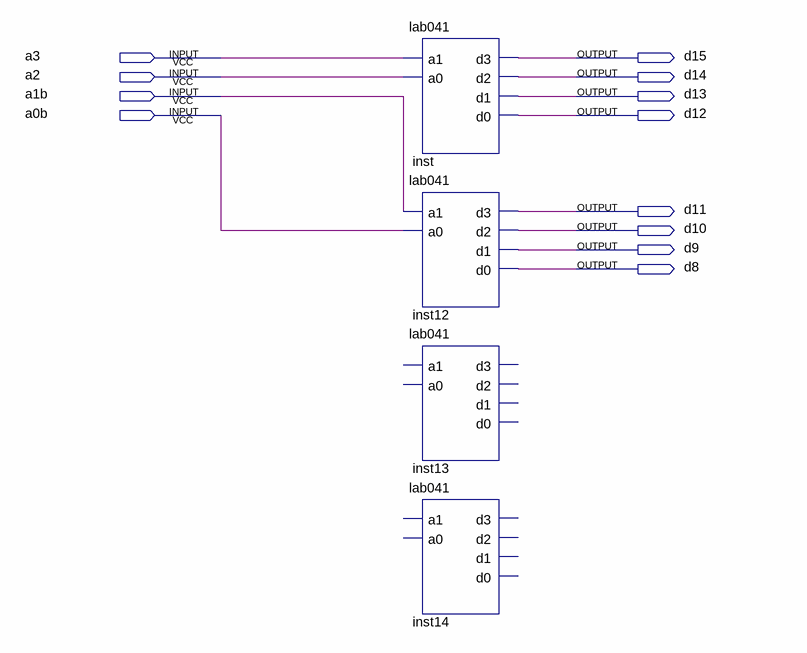
[diagram p0: schematic sheet]
// Quartus schematic lab041bkp.bdf as structural Verilog: 4 symbols, 12 pins
module lab041bkp (
  input  a3,
  input  a2,
  input  a1b,
  input  a0b,
  output d15,
  output d14,
  output d13,
  output d12,
  output d11,
  output d10,
  output d9,
  output d8
);

  lab041 inst (.a1(a3), .a0(a2), .d3(d15), .d2(d14), .d1(d13), .d0(d12));
  lab041 inst12 (.a1(a1b), .a0(a0b), .d3(d11), .d2(d10), .d1(d9), .d0(d8));
  lab041 inst13 ();  // open: a1, a0, d3, d2, d1, d0
  lab041 inst14 ();  // open: a1, a0, d3, d2, d1, d0
endmodule
